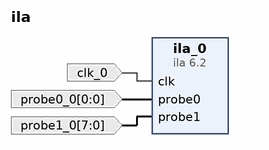
[diagram p0: block diagram of the top level]
# Vivado block design ila, xck26-sfvc784-2LV-c, Vivado 2023.1
create_bd_design ila

create_bd_port -dir I -type clk clk_0
create_bd_port -dir I -from 0 -to 0 probe0_0
create_bd_port -dir I -from 7 -to 0 probe1_0

create_bd_cell -type ip -vlnv xilinx.com:ip:ila:6.2 ila_0
set_property -dict [list \
  CONFIG.C_ADV_TRIGGER false \
  CONFIG.C_DATA_DEPTH 4096 \
  CONFIG.C_MONITOR_TYPE Native \
  CONFIG.C_NUM_OF_PROBES 2 \
  CONFIG.C_PROBE1_WIDTH 8 \
  CONFIG.C_TRIGIN_EN false \
] [get_bd_cells ila_0]

# ---- connections ----

connect_bd_net -net clk_0_1 [get_bd_ports clk_0] [get_bd_pins ila_0/clk]
connect_bd_net -net probe0_0_1 [get_bd_ports probe0_0] [get_bd_pins ila_0/probe0]
connect_bd_net -net probe1_0_1 [get_bd_ports probe1_0] [get_bd_pins ila_0/probe1]

validate_bd_design
save_bd_design
